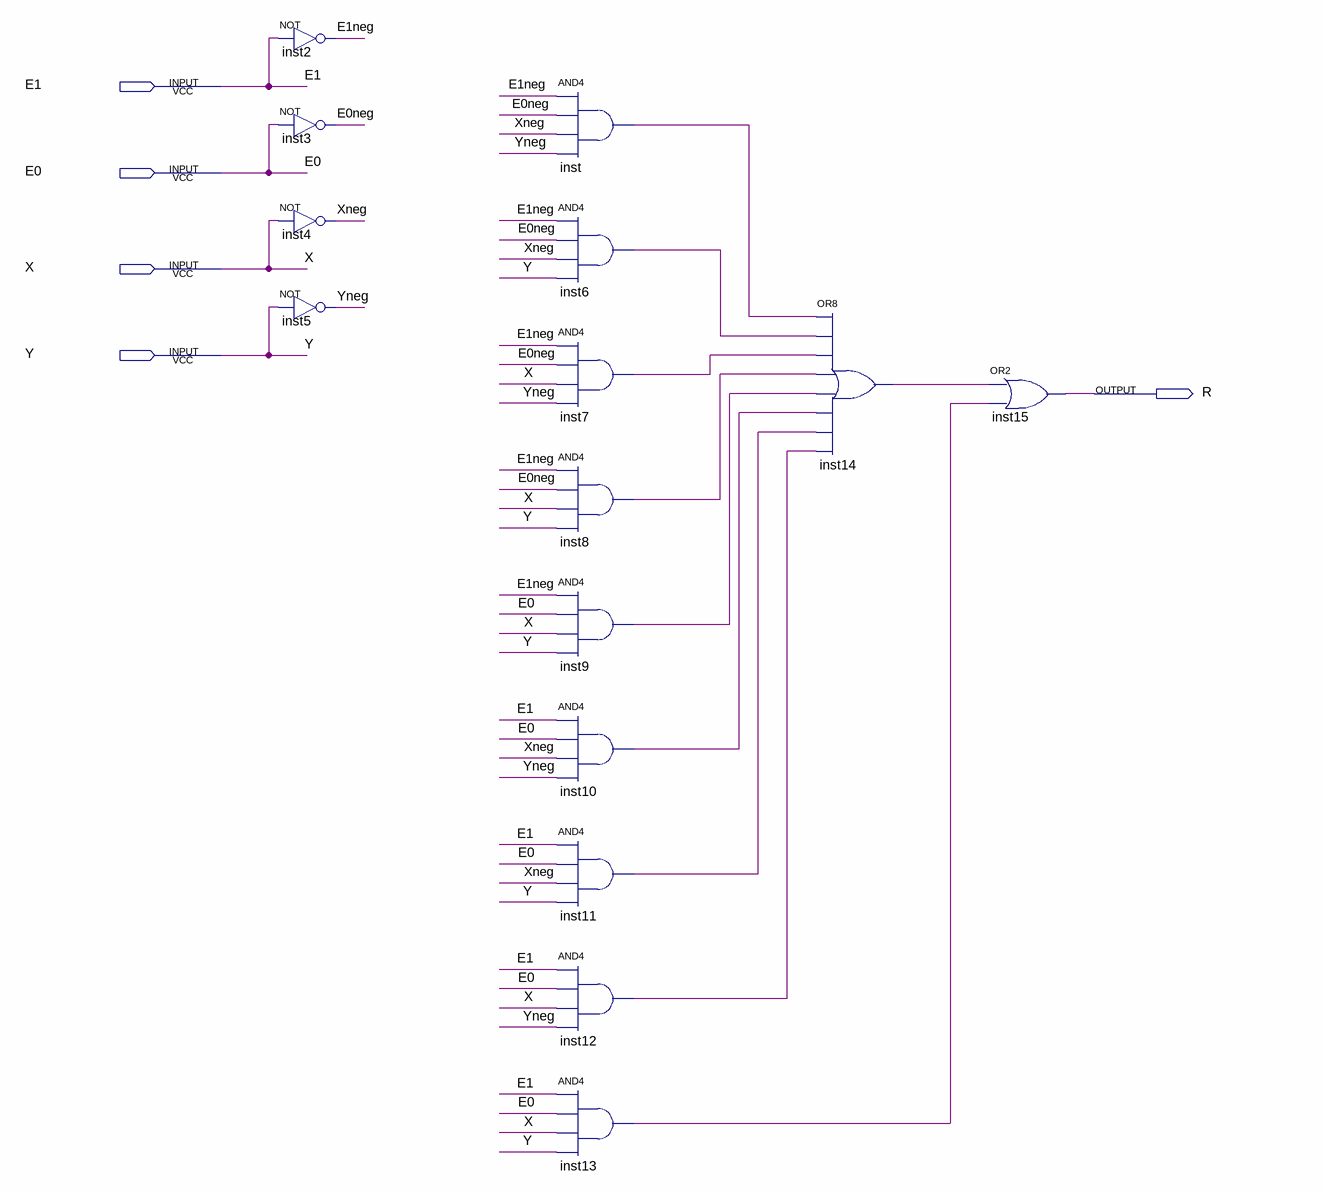
[diagram p0: schematic sheet]
// Quartus schematic abk_mealy.bdf as structural Verilog: 15 symbols, 5 pins
module abk_mealy (
  input  E1,
  input  E0,
  input  X,
  input  Y,
  output R
);

  wire E0neg, E1neg, inst6_out, inst7_out, inst8_out, inst9_out, inst10_out, inst11_out, inst12_out,
       inst13_out, inst14_out, inst_out, Xneg, Yneg;

  not inst2 (E1neg, E1);
  not inst3 (E0neg, E0);
  not inst4 (Xneg, X);
  not inst5 (Yneg, Y);
  and inst (inst_out, E1neg, E0neg, Xneg, Yneg);
  and inst6 (inst6_out, E1neg, E0neg, Xneg, Y);
  and inst7 (inst7_out, E1neg, E0neg, X, Yneg);
  and inst8 (inst8_out, E1neg, E0neg, X, Y);
  and inst9 (inst9_out, E1neg, E0, X, Y);
  and inst10 (inst10_out, E1, E0, Xneg, Yneg);
  and inst11 (inst11_out, E1, E0, Xneg, Y);
  and inst12 (inst12_out, E1, E0, X, Yneg);
  and inst13 (inst13_out, E1, E0, X, Y);
  or inst14 (inst14_out, inst_out, inst6_out, inst7_out, inst8_out, inst9_out, inst10_out, inst11_out, inst12_out);
  or inst15 (R, inst14_out, inst13_out);
endmodule
